# EAGLE schematic keyBoard_B (EAGLE 6.3)

## Sheet 1 of 2: all
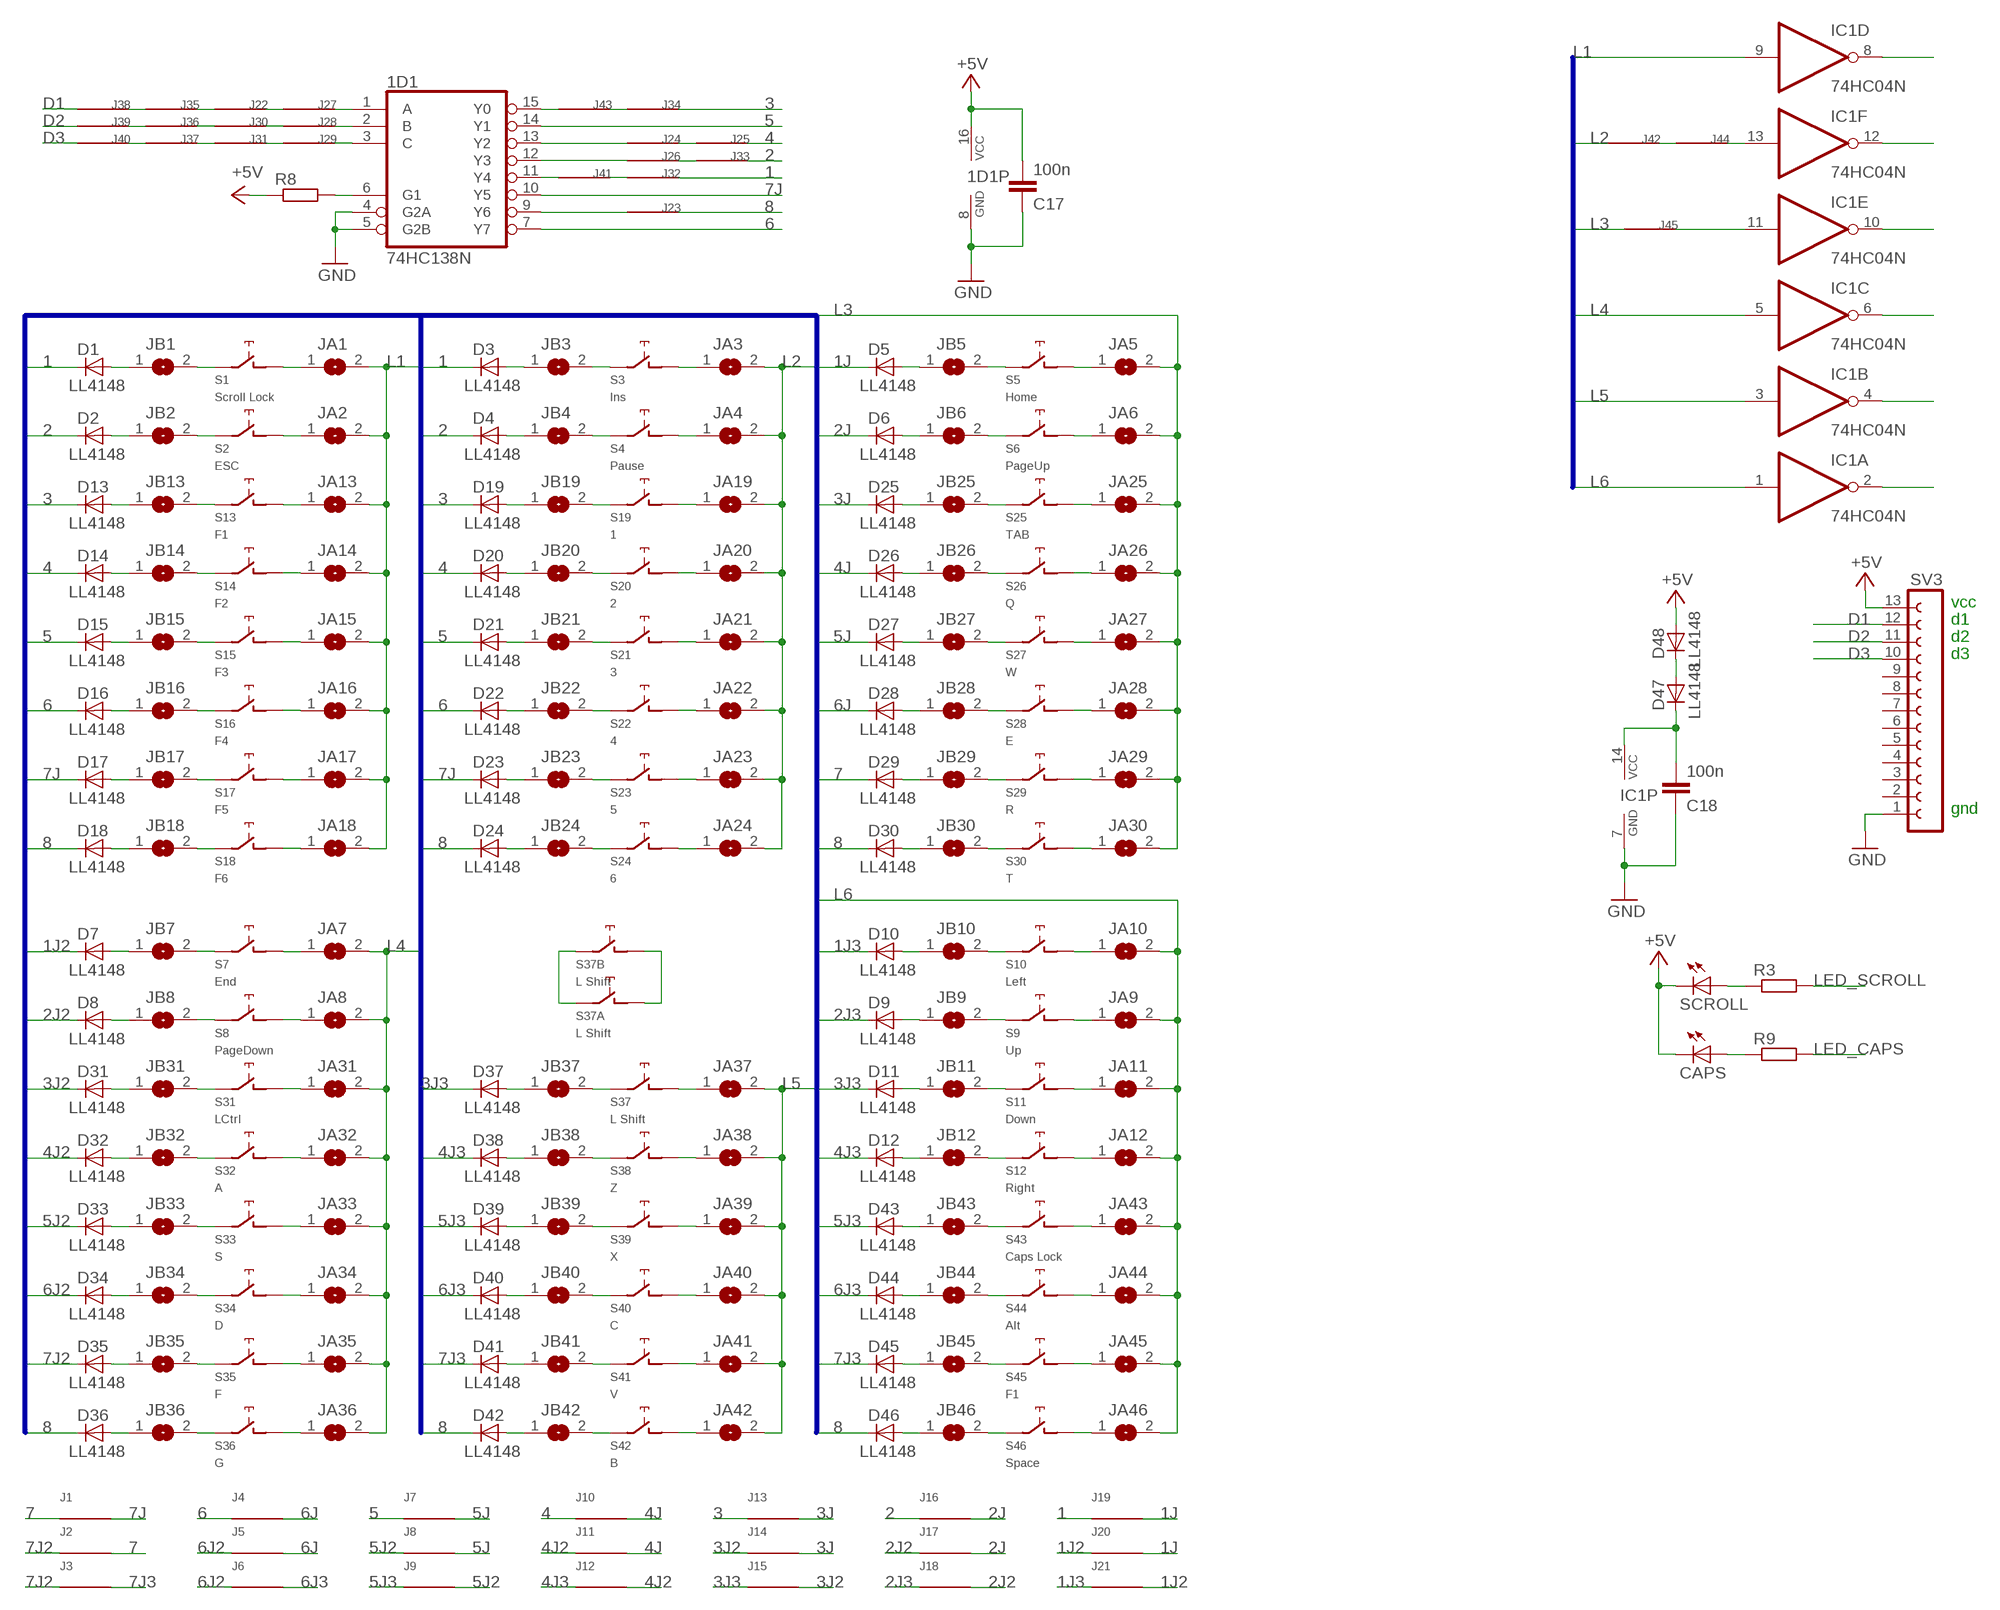
[diagram p0: schematic, sheet 1, part 1 of 2]
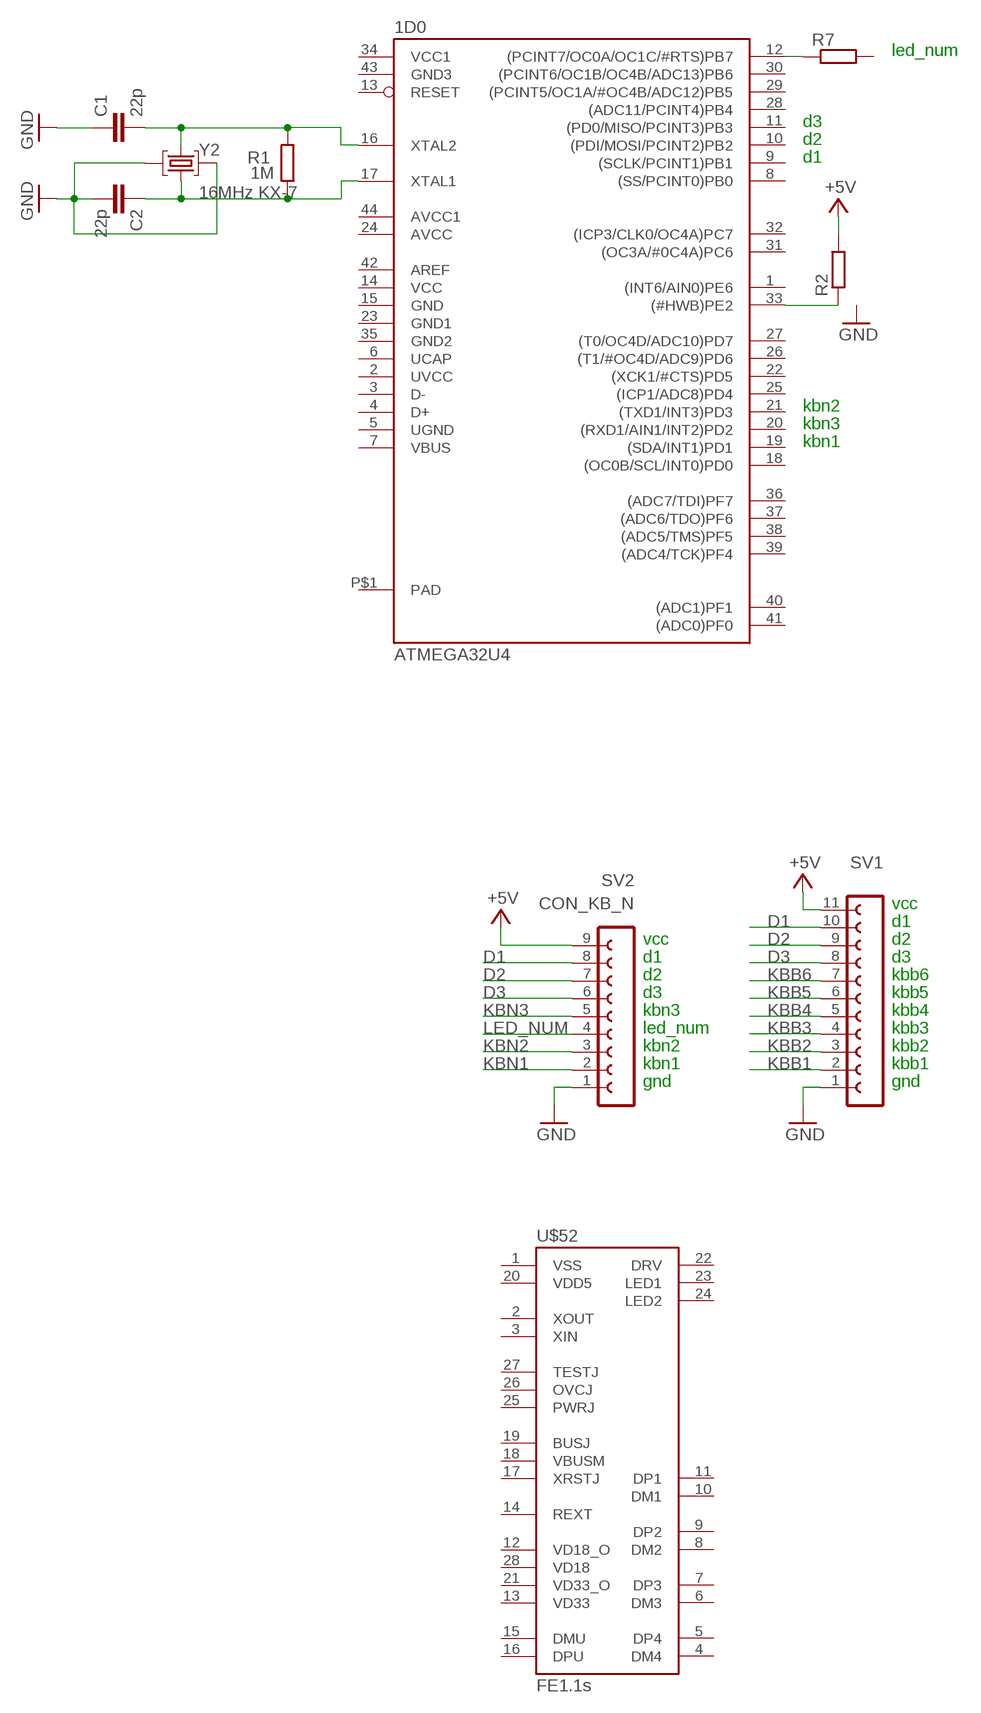
[diagram p1: schematic, sheet 1, part 2 of 2]

### Parts
1D0  ATMEGA32U4  SMARTPRJ_ATMEGA32U4-XUAU  [SMARTPRJ_TQFP44-PAD]
1D1  74HC138N  [DIL16]
C1  22p  C-EUC0603  [C0603-ROUND]
C2  22p  C-EUC0603  [C0603-ROUND]
C17  100n  C-EUC0805  [C0805]
C18  100n  C-EUC0805  [C0805]
CAPS  LED5MM  [LED5MM]
D1  LL4148  [SOD80C]
D2  LL4148  [SOD80C]
D3  LL4148  [SOD80C]
D4  LL4148  [SOD80C]
D5  LL4148  [SOD80C]
D6  LL4148  [SOD80C]
D7  LL4148  [SOD80C]
D8  LL4148  [SOD80C]
D9  LL4148  [SOD80C]
D10  LL4148  [SOD80C]
D11  LL4148  [SOD80C]
D12  LL4148  [SOD80C]
D13  LL4148  [SOD80C]
D14  LL4148  [SOD80C]
D15  LL4148  [SOD80C]
D16  LL4148  [SOD80C]
D17  LL4148  [SOD80C]
D18  LL4148  [SOD80C]
D19  LL4148  [SOD80C]
D20  LL4148  [SOD80C]
D21  LL4148  [SOD80C]
D22  LL4148  [SOD80C]
D23  LL4148  [SOD80C]
D24  LL4148  [SOD80C]
D25  LL4148  [SOD80C]
D26  LL4148  [SOD80C]
D27  LL4148  [SOD80C]
D28  LL4148  [SOD80C]
D29  LL4148  [SOD80C]
D30  LL4148  [SOD80C]
D31  LL4148  [SOD80C]
D32  LL4148  [SOD80C]
D33  LL4148  [SOD80C]
D34  LL4148  [SOD80C]
D35  LL4148  [SOD80C]
D36  LL4148  [SOD80C]
D37  LL4148  [SOD80C]
D38  LL4148  [SOD80C]
D39  LL4148  [SOD80C]
D40  LL4148  [SOD80C]
D41  LL4148  [SOD80C]
D42  LL4148  [SOD80C]
D43  LL4148  [SOD80C]
D44  LL4148  [SOD80C]
D45  LL4148  [SOD80C]
D46  LL4148  [SOD80C]
D47  LL4148  [SOD80C]
D48  LL4148  [SOD80C]
IC1  74HC04N  74ACT04N  [DIL14]
J1  J  [R1206W]
J2  J  [R1206W]
J3  J  [R1206W]
J4  J  [R1206W]
J5  J  [R1206W]
J6  J  [R1206W]
J7  J  [R1206W]
J8  J  [R1206W]
J9  J  [R1206W]
J10  J  [R1206W]
J11  J  [R1206W]
J12  J  [R1206W]
J13  J  [R1206W]
J14  J  [R1206W]
J15  J  [R1206W]
J16  J  [R1206W]
J17  J  [R1206W]
J18  J  [R1206W]
J19  J  [R1206W]
J20  J  [R1206W]
J21  J  [R1206W]
J22  J  [R1206W]
J23  J  [R1206W]
J24  J  [R1206W]
J25  J  [R1206W]
J26  J  [R1206W]
J27  J  [R1206W]
J28  J  [R1206W]
J29  J  [R1206W]
J30  J  [R1206W]
J31  J  [R1206W]
J32  J  [R1206W]
J33  J  [R1206W]
J34  J  [R1206W]
J35  J  [R1206W]
J36  J  [R1206W]
J37  J  [R1206W]
J38  J  [R1206W]
J39  J  [R1206W]
J40  J  [R1206W]
J41  J  [R1206W]
J42  J  [R1206W]
J43  J  [R1206W]
J44  J  [R1206W]
J45  J  [R1206W]
JA1  SJ  [SJ]
JA2  SJ  [SJ]
JA3  SJ  [SJ]
JA4  SJ  [SJ]
JA5  SJ  [SJ]
JA6  SJ  [SJ]
JA7  SJ  [SJ]
JA8  SJ  [SJ]
JA9  SJ  [SJ]
JA10  SJ  [SJ]
JA11  SJ  [SJ]
JA12  SJ  [SJ]
JA13  SJ  [SJ]
JA14  SJ  [SJ]
JA15  SJ  [SJ]
JA16  SJ  [SJ]
JA17  SJ  [SJ]
JA18  SJ  [SJ]
JA19  SJ  [SJ]
JA20  SJ  [SJ]
JA21  SJ  [SJ]
JA22  SJ  [SJ]
JA23  SJ  [SJ]
JA24  SJ  [SJ]
JA25  SJ  [SJ]
JA26  SJ  [SJ]
JA27  SJ  [SJ]
JA28  SJ  [SJ]
JA29  SJ  [SJ]
JA30  SJ  [SJ]
JA31  SJ  [SJ]
JA32  SJ  [SJ]
JA33  SJ  [SJ]
JA34  SJ  [SJ]
JA35  SJ  [SJ]
JA36  SJ  [SJ]
JA37  SJ  [SJ]
JA38  SJ  [SJ]
JA39  SJ  [SJ]
JA40  SJ  [SJ]
JA41  SJ  [SJ]
JA42  SJ  [SJ]
JA43  SJ  [SJ]
JA44  SJ  [SJ]
JA45  SJ  [SJ]
JA46  SJ  [SJ]
JB1  SJ  [SJ]
JB2  SJ  [SJ@1]
JB3  SJ  [SJ]
JB4  SJ  [SJ]
JB5  SJ  [SJ@1]
JB6  SJ  [SJ]
JB7  SJ  [SJ]
JB8  SJ  [SJ]
JB9  SJ  [SJ]
JB10  SJ  [SJ]
JB11  SJ  [SJ]
JB12  SJ  [SJ]
JB13  SJ  [SJ]
JB14  SJ  [SJ@1]
JB15  SJ  [SJ@1]
JB16  SJ  [SJ]
JB17  SJ  [SJ]
JB18  SJ  [SJ]
JB19  SJ  [SJ]
JB20  SJ  [SJ]
JB21  SJ  [SJ]
JB22  SJ  [SJ]
JB23  SJ  [SJ]
JB24  SJ  [SJ]
JB25  SJ  [SJ]
JB26  SJ  [SJ]
JB27  SJ  [SJ]
JB28  SJ  [SJ]
JB29  SJ  [SJ]
JB30  SJ  [SJ]
JB31  SJ  [SJ]
JB32  SJ  [SJ]
JB33  SJ  [SJ]
JB34  SJ  [SJ]
JB35  SJ  [SJ]
JB36  SJ  [SJ]
JB37  SJ  [SJ]
JB38  SJ  [SJ]
JB39  SJ  [SJ]
JB40  SJ  [SJ]
JB41  SJ  [SJ]
JB42  SJ  [SJ]
JB43  SJ  [SJ]
JB44  SJ  [SJ]
JB45  SJ  [SJ]
JB46  SJ  [SJ]
R1  1M  R-EU_R0603  [R0603-ROUND]
R2  R-EU_M0805  [M0805]
R3  R-EU_R1206W  [R1206W]
R7  R-EU_M0805  [M0805]
R8  R-EU_R1206W  [R1206W]
R9  R-EU_R1206W  [R1206W]
S1  Scroll Lock  CHERRY-MX-4P  [CHERRY-MX-4P]
S2  ESC  CHERRY-MX-4P  [CHERRY-MX-4P]
S3  Ins  CHERRY-MX-4P  [CHERRY-MX-4P]
S4  Pause  CHERRY-MX-4P  [CHERRY-MX-4P]
S5  Home  CHERRY-MX-4P  [CHERRY-MX-4P]
S6  PageUp  CHERRY-MX-4P  [CHERRY-MX-4P]
S7  End  CHERRY-MX-4P  [CHERRY-MX-4P]
S8  PageDown  CHERRY-MX-4P  [CHERRY-MX-4P]
S9  Up  CHERRY-MX-4P  [CHERRY-MX-4P]
S10  Left  CHERRY-MX-4P  [CHERRY-MX-4P]
S11  Down  CHERRY-MX-4P  [CHERRY-MX-4P]
S12  Right  CHERRY-MX-4P  [CHERRY-MX-4P]
S13  F1  CHERRY-MX-4P  [CHERRY-MX-4P]
S14  F2  CHERRY-MX-4P  [CHERRY-MX-4P]
S15  F3  CHERRY-MX-4P  [CHERRY-MX-4P]
S16  F4  CHERRY-MX-4P  [CHERRY-MX-4P]
S17  F5  CHERRY-MX-4P  [CHERRY-MX-4P]
S18  F6  CHERRY-MX-4P  [CHERRY-MX-4P]
S19  1  CHERRY-MX-4P  [CHERRY-MX-4P]
S20  2  CHERRY-MX-4P  [CHERRY-MX-4P]
S21  3  CHERRY-MX-4P  [CHERRY-MX-4P]
S22  4  CHERRY-MX-4P  [CHERRY-MX-4P]
S23  5  CHERRY-MX-4P  [CHERRY-MX-4P]
S24  6  CHERRY-MX-4P  [CHERRY-MX-4P]
S25  TAB  CHERRY-MX-4P  [CHERRY-MX-4P]
S26  Q  CHERRY-MX-4P  [CHERRY-MX-4P]
S27  W  CHERRY-MX-4P  [CHERRY-MX-4P]
S28  E  CHERRY-MX-4P  [CHERRY-MX-4P]
S29  R  CHERRY-MX-4P  [CHERRY-MX-4P]
S30  T  CHERRY-MX-4P  [CHERRY-MX-4P]
S31  LCtrl  CHERRY-MX-4P  [CHERRY-MX-4P]
S32  A  CHERRY-MX-4P  [CHERRY-MX-4P]
S33  S  CHERRY-MX-4P  [CHERRY-MX-4P]
S34  D  CHERRY-MX-4P  [CHERRY-MX-4P]
S35  F  CHERRY-MX-4P  [CHERRY-MX-4P]
S36  G  CHERRY-MX-4P  [CHERRY-MX-4P]
S37  L Shift  CHERRY-MX  [CHERRY-MX]
S37A  L Shift  CHERRY-MX  [CHERRY-MX]
S37B  L Shift  CHERRY-MX  [CHERRY-MX]
S38  Z  CHERRY-MX-4P  [CHERRY-MX-4P]
S39  X  CHERRY-MX-4P  [CHERRY-MX-4P]
S40  C  CHERRY-MX-4P  [CHERRY-MX-4P]
S41  V  CHERRY-MX-4P  [CHERRY-MX-4P]
S42  B  CHERRY-MX-4P  [CHERRY-MX-4P]
S43  Caps Lock  CHERRY-MX-4P  [CHERRY-MX-4P]
S44  Alt  CHERRY-MX-4P  [CHERRY-MX-4P]
S45  F1  CHERRY-MX-4P  [CHERRY-MX-4P]
S46  Space  CHERRY-MX-4P  [CHERRY-MX-4P]
SCROLL  LED5MM  [LED5MM]
SV1  FE12-1  [FE12]
SV2  CON_KB_N  FE09-1  [FE09]
SV3  FE13-1  [FE13]
U$52  FE1.1S  [FE1.1S_SSOP-28]
Y2  16MHz KX-7  CRYSTAL-3.2-2.5  [CRYSTAL-3.2-2.5]

### Nets
1: D1.C D3.C J19.2 J32.1
1J: D5.C J19.1 J20.1
1J2: D7.C J20.2 J21.1
1J3: D10.C J21.2
2: D2.C D4.C J16.2 J33.1
2J: D6.C J16.1 J17.1
2J2: D8.C J17.2 J18.1
2J3: D9.C J18.2
3: D13.C D19.C J13.2 J34.1
3J: D25.C J13.1 J14.1
3J2: D31.C J14.2 J15.1
3J3: D11.C D37.C J15.2
4: D14.C D20.C J10.2 J25.1
4J: D26.C J10.1 J11.1
4J2: D32.C J11.2 J12.1
4J3: D12.C D38.C J12.2
5: 1D1.14(Y1) D15.C D21.C J7.2
5J: D27.C J7.1 J8.1
5J2: D33.C J8.2 J9.1
5J3: D39.C D43.C J9.2
6: 1D1.7(Y7) D16.C D22.C J4.2
6J: D28.C J4.1 J5.1
6J2: D34.C J5.2 J6.2
6J3: D40.C D44.C J6.1
7: D29.C J1.2 J2.1
7J: 1D1.10(Y5) D17.C D23.C J1.1
7J2: D35.C J2.2 J3.2
7J3: D41.C D45.C J3.1
8: D18.C D24.C D30.C D36.C D42.C D46.C J23.1
+5V: 1D1.16(VCC) C17.2 CAPS.K(C) D48.A R2.2 R8.1 SCROLL.K(C) SV1.11 SV2.9 SV3.13 ; also sheet 2
D1: J38.2 SV1.10 SV2.8 SV3.12
D2: J39.2 SV1.9 SV2.7 SV3.11
D3: J40.2 SV1.8 SV2.6 SV3.10
GND: 1D1.4(G2A) 1D1.5(G2B) 1D1.8(GND) C1.1 C2.2 C17.1 C18.1 IC1.7(P:GND) SV1.1 SV2.1 SV3.1 Y2.2(GND) Y2.4(GND) ; also sheet 2
KBB1: SV1.2
KBB2: SV1.3
KBB3: SV1.4
KBB4: SV1.5
KBB5: SV1.6
KBB6: SV1.7
KBN1: SV2.2
KBN2: SV2.3
KBN3: SV2.5
L1: IC1.9(D:I) JA1.2 JA2.2 JA13.2 JA14.2 JA15.2 JA16.2 JA17.2 JA18.2
L2: J42.2 JA3.2 JA4.2 JA19.2 JA20.2 JA21.2 JA22.2 JA23.2 JA24.2
L3: J45.2 JA5.2 JA6.2 JA25.2 JA26.2 JA27.2 JA28.2 JA29.2 JA30.2
L4: IC1.5(C:I) JA7.2 JA8.2 JA31.2 JA32.2 JA33.2 JA34.2 JA35.2 JA36.2
L5: IC1.3(B:I) JA37.2 JA38.2 JA39.2 JA40.2 JA41.2 JA42.2
L6: IC1.1(A:I) JA9.2 JA10.2 JA11.2 JA12.2 JA43.2 JA44.2 JA45.2 JA46.2
LED_CAPS: R9.2
LED_NUM: SV2.4
LED_SCROLL: R3.2
N$1: D15.A JB15.1
N$2: JB4.2 S4.SW1(PIN-1)
N$3: D1.A JB1.1
N$4: JA4.1 S4.SW2(PIN-2)
N$5: JB14.2 S14.SW1(PIN-1)
N$6: JB20.2 S20.SW1(PIN-1)
N$7: JB32.2 S32.SW1(PIN-1)
N$8: JB38.2 S38.SW1(PIN-1)
N$9: JB6.2 S6.SW1(PIN-1)
N$10: JA6.1 S6.SW2(PIN-2)
N$11: JA8.1 S8.SW2(PIN-2)
N$12: JB8.2 S8.SW1(PIN-1)
N$13: JB10.2 S10.SW1(PIN-1)
N$14: JB1.2 S1.SW1(PIN-1)
N$15: D2.A JB2.1
N$16: JB2.2 S2.SW1(PIN-1)
N$17: JA2.1 S2.SW2(PIN-2)
N$18: D16.A JB16.1
N$19: JB3.2 S3.SW1(PIN-1)
N$20: JB5.2 S5.SW1(PIN-1)
N$21: JB7.2 S7.SW1(PIN-1)
N$22: JB9.2 S9.SW1(PIN-1)
N$23: JB11.2 S11.SW1(PIN-1)
N$24: D3.A JB3.1
N$25: JB12.2 S12.SW1(PIN-1)
N$26: D5.A JB5.1
N$27: D7.A JB7.1
N$28: JA10.1 S10.SW2(PIN-2)
N$29: JA1.1 S1.SW2(PIN-2)
N$30: D9.A JB9.1
N$31: D11.A JB11.1
N$32: JA3.1 S3.SW2(PIN-2)
N$33: JA5.1 S5.SW2(PIN-2)
N$34: JA7.1 S7.SW2(PIN-2)
N$35: JA9.1 S9.SW2(PIN-2)
N$36: JA11.1 S11.SW2(PIN-2)
N$37: JA12.1 S12.SW2(PIN-2)
N$38: JA14.1 S14.SW2(PIN-2)
N$39: JB13.2 S13.SW1(PIN-1)
N$40: JA13.1 S13.SW2(PIN-2)
N$41: D14.A JB14.1
N$42: JB42.2 S42.SW1(PIN-1)
N$43: JA42.1 S42.SW2(PIN-2)
N$44: JB27.2 S27.SW1(PIN-1)
N$45: JA27.1 S27.SW2(PIN-2)
N$46: JB17.2 S17.SW1(PIN-1)
N$47: JA17.1 S17.SW2(PIN-2)
N$48: D24.A JB24.1
N$49: JB24.2 S24.SW1(PIN-1)
N$50: JA24.1 S24.SW2(PIN-2)
N$51: J22.1 J27.2
N$52: D4.A JB4.1
N$53: D6.A JB6.1
N$54: D8.A JB8.1
N$55: D10.A JB10.1
N$56: D12.A JB12.1
N$57: D13.A JB13.1
N$58: JB19.2 S19.SW1(PIN-1)
N$59: JB25.2 S25.SW1(PIN-1)
N$60: 1D1.9(Y6) J23.2
N$61: JB31.2 S31.SW1(PIN-1)
N$62: JB37.2 S37.SW1(PIN-1)
N$63: JB43.2 S43.SW1(PIN-1)
N$64: JB26.2 S26.SW1(PIN-1)
N$65: JB44.2 S44.SW1(PIN-1)
N$66: JB18.2 S18.SW1(PIN-1)
N$67: 1D1.13(Y2) J24.2
N$68: JB30.2 S30.SW1(PIN-1)
N$69: JB36.2 S36.SW1(PIN-1)
N$70: J24.1 J25.2
N$72: JB23.2 S23.SW1(PIN-1)
N$73: JB29.2 S29.SW1(PIN-1)
N$74: JB35.2 S35.SW1(PIN-1)
N$75: JB41.2 S41.SW1(PIN-1)
N$76: JB16.2 S16.SW1(PIN-1)
N$77: JB22.2 S22.SW1(PIN-1)
N$78: JB28.2 S28.SW1(PIN-1)
N$79: JB34.2 S34.SW1(PIN-1)
N$80: JB40.2 S40.SW1(PIN-1)
N$81: JB46.2 S46.SW1(PIN-1)
N$82: JB15.2 S15.SW1(PIN-1)
N$83: JB21.2 S21.SW1(PIN-1)
N$85: JB33.2 S33.SW1(PIN-1)
N$86: JB39.2 S39.SW1(PIN-1)
N$87: JB45.2 S45.SW1(PIN-1)
N$88: JA15.1 S15.SW2(PIN-2)
N$90: JA18.1 S18.SW2(PIN-2)
N$91: JA20.1 S20.SW2(PIN-2)
N$92: JA22.1 S22.SW2(PIN-2)
N$93: JA23.1 S23.SW2(PIN-2)
N$95: JA25.1 S25.SW2(PIN-2)
N$96: JA26.1 S26.SW2(PIN-2)
N$98: JA28.1 S28.SW2(PIN-2)
N$99: JA29.1 S29.SW2(PIN-2)
N$100: JA30.1 S30.SW2(PIN-2)
N$101: JA31.1 S31.SW2(PIN-2)
N$102: JA32.1 S32.SW2(PIN-2)
N$103: JA33.1 S33.SW2(PIN-2)
N$104: JA34.1 S34.SW2(PIN-2)
N$105: JA35.1 S35.SW2(PIN-2)
N$106: JA36.1 S36.SW2(PIN-2)
N$107: S37A.SW1(PIN-1) S37B.SW1(PIN-1)
N$108: JA38.1 S38.SW2(PIN-2)
N$109: JA39.1 S39.SW2(PIN-2)
N$110: JA40.1 S40.SW2(PIN-2)
N$111: JA41.1 S41.SW2(PIN-2)
N$113: JA43.1 S43.SW2(PIN-2)
N$114: JA45.1 S45.SW2(PIN-2)
N$115: JA46.1 S46.SW2(PIN-2)
N$116: JA19.1 S19.SW2(PIN-2)
N$117: JA44.1 S44.SW2(PIN-2)
N$118: JA21.1 S21.SW2(PIN-2)
N$119: JA16.1 S16.SW2(PIN-2)
N$120: D17.A JB17.1
N$121: D18.A JB18.1
N$122: D19.A JB19.1
N$123: D20.A JB20.1
N$124: D21.A JB21.1
N$125: D22.A JB22.1
N$126: D23.A JB23.1
N$128: D25.A JB25.1
N$129: D26.A JB26.1
N$130: D27.A JB27.1
N$131: D28.A JB28.1
N$132: D29.A JB29.1
N$133: D30.A JB30.1
N$134: D31.A JB31.1
N$135: D32.A JB32.1
N$136: D33.A JB33.1
N$137: D34.A JB34.1
N$138: D35.A JB35.1
N$139: D36.A JB36.1
N$140: D37.A JB37.1
N$141: D38.A JB38.1
N$142: D39.A JB39.1
N$143: D40.A JB40.1
N$144: D41.A JB41.1
N$145: D42.A JB42.1
N$146: D43.A JB43.1
N$147: D44.A JB44.1
N$148: D45.A JB45.1
N$149: D46.A JB46.1
N$150: J42.1 J44.2
N$158: 1D1.15(Y0) J43.2
N$163: 1D1.1(A) J27.1
N$165: 1D1.2(B) J28.1
N$172: 1D1.3(C) J29.1
N$175: J28.2 J30.1
N$176: J29.2 J31.1
N$178: J26.1 J33.2
N$181: C18.2 D47.C IC1.14(P:VCC)
N$182: J35.2 J38.1
N$183: J36.2 J39.1
N$184: J37.2 J40.1
N$185: J31.2 J37.1
N$186: J30.2 J36.1
N$187: J22.2 J35.1
N$188: J32.2 J41.1
N$189: 1D1.11(Y4) J41.2
N$190: 1D1.12(Y3) J26.2
N$191: J34.2 J43.1
N$192: D47.A D48.C
N$193: IC1.11(E:I) J45.1
N$194: IC1.13(F:I) J44.1
N$195: IC1.12(F:O)
N$196: IC1.10(E:O)
N$197: 1D0.33((#HWB)PE2) R2.1
N$198: IC1.2(A:O)
N$199: IC1.4(B:O)
N$200: IC1.6(C:O)
N$203: IC1.8(D:O)
N$231: R3.1 SCROLL.A
N$232: CAPS.A R9.1
N$273: JA37.1 S37.SW2(PIN-2)
N$274: S37A.SW2(PIN-2) S37B.SW2(PIN-2)
N$284: 1D0.12((PCINT7/OC0A/OC1C/#RTS)PB7) R7.1
N$390: 1D1.6(G1) R8.2
XTAL3: 1D0.16(XTAL2) C1.2 R1.2 Y2.3(C2)
XTAL4: 1D0.17(XTAL1) C2.1 R1.1 Y2.1(C1)
Unconnected: 1D0.1((INT6/AIN0)PE6) 1D0.3(D-) 1D0.4(D+) 1D0.6(UCAP) 1D0.7(VBUS) 1D0.8((SS/PCINT0)PB0) 1D0.9((SCLK/PCINT1)PB1) 1D0.10((PDI/MOSI/PCINT2)PB2) 1D0.11((PD0/MISO/PCINT3)PB3) 1D0.13(RESET) 1D0.18((OC0B/SCL/INT0)PD0) 1D0.19((SDA/INT1)PD1) 1D0.20((RXD1/AIN1/INT2)PD2) 1D0.21((TXD1/INT3)PD3) 1D0.22((XCK1/#CTS)PD5) 1D0.25((ICP1/ADC8)PD4) 1D0.26((T1/#OC4D/ADC9)PD6) 1D0.27((T0/OC4D/ADC10)PD7) 1D0.28((ADC11/PCINT4)PB4) 1D0.29((PCINT5/OC1A/#OC4B/ADC12)PB5) 1D0.30((PCINT6/OC1B/OC4B/ADC13)PB6) 1D0.31((OC3A/#0C4A)PC6) 1D0.32((ICP3/CLK0/OC4A)PC7) 1D0.36((ADC7/TDI)PF7) 1D0.37((ADC6/TDO)PF6) 1D0.38((ADC5/TMS)PF5) 1D0.39((ADC4/TCK)PF4) 1D0.40((ADC1)PF1) 1D0.41((ADC0)PF0) R7.2 S1.D1(_D:D1) S1.D2(_D:D2) S1.LED1(_L:LED1) S1.LED2(_L:LED2) S2.D1(_D:D1) S2.D2(_D:D2) S2.LED1(_L:LED1) S2.LED2(_L:LED2) S3.D1(_D:D1) S3.D2(_D:D2) S3.LED1(_L:LED1) S3.LED2(_L:LED2) S4.D1(_D:D1) S4.D2(_D:D2) S4.LED1(_L:LED1) S4.LED2(_L:LED2) S5.D1(_D:D1) S5.D2(_D:D2) S5.LED1(_L:LED1) S5.LED2(_L:LED2) S6.D1(_D:D1) S6.D2(_D:D2) S6.LED1(_L:LED1) S6.LED2(_L:LED2) S7.D1(_D:D1) S7.D2(_D:D2) S7.LED1(_L:LED1) S7.LED2(_L:LED2) S8.D1(_D:D1) S8.D2(_D:D2) S8.LED1(_L:LED1) S8.LED2(_L:LED2) S9.D1(_D:D1) S9.D2(_D:D2) S9.LED1(_L:LED1) S9.LED2(_L:LED2) S10.D1(_D:D1) S10.D2(_D:D2) S10.LED1(_L:LED1) S10.LED2(_L:LED2) S11.D1(_D:D1) S11.D2(_D:D2) S11.LED1(_L:LED1) S11.LED2(_L:LED2) S12.D1(_D:D1) S12.D2(_D:D2) S12.LED1(_L:LED1) S12.LED2(_L:LED2) S13.D1(_D:D1) S13.D2(_D:D2) S13.LED1(_L:LED1) S13.LED2(_L:LED2) S14.D1(_D:D1) S14.D2(_D:D2) S14.LED1(_L:LED1) S14.LED2(_L:LED2) S15.D1(_D:D1) S15.D2(_D:D2) S15.LED1(_L:LED1) S15.LED2(_L:LED2) S16.D1(_D:D1) S16.D2(_D:D2) S16.LED1(_L:LED1) S16.LED2(_L:LED2) S17.D1(_D:D1) S17.D2(_D:D2) S17.LED1(_L:LED1) S17.LED2(_L:LED2) S18.D1(_D:D1) S18.D2(_D:D2) S18.LED1(_L:LED1) S18.LED2(_L:LED2) S19.D1(_D:D1) S19.D2(_D:D2) S19.LED1(_L:LED1) S19.LED2(_L:LED2) S20.D1(_D:D1) S20.D2(_D:D2) S20.LED1(_L:LED1) S20.LED2(_L:LED2) S21.D1(_D:D1) S21.D2(_D:D2) S21.LED1(_L:LED1) S21.LED2(_L:LED2) S22.D1(_D:D1) S22.D2(_D:D2) S22.LED1(_L:LED1) S22.LED2(_L:LED2) S23.D1(_D:D1) S23.D2(_D:D2) S23.LED1(_L:LED1) S23.LED2(_L:LED2) S24.D1(_D:D1) S24.D2(_D:D2) S24.LED1(_L:LED1) S24.LED2(_L:LED2) S25.D1(_D:D1) S25.D2(_D:D2) S25.LED1(_L:LED1) S25.LED2(_L:LED2) S26.D1(_D:D1) S26.D2(_D:D2) S26.LED1(_L:LED1) S26.LED2(_L:LED2) S27.D1(_D:D1) S27.D2(_D:D2) S27.LED1(_L:LED1) S27.LED2(_L:LED2) S28.D1(_D:D1) S28.D2(_D:D2) S28.LED1(_L:LED1) S28.LED2(_L:LED2) S29.D1(_D:D1) S29.D2(_D:D2) S29.LED1(_L:LED1) S29.LED2(_L:LED2) S30.D1(_D:D1) S30.D2(_D:D2) S30.LED1(_L:LED1) S30.LED2(_L:LED2) S31.D1(_D:D1) S31.D2(_D:D2) S31.LED1(_L:LED1) S31.LED2(_L:LED2) S32.D1(_D:D1) S32.D2(_D:D2) S32.LED1(_L:LED1) S32.LED2(_L:LED2) S33.D1(_D:D1) S33.D2(_D:D2) S33.LED1(_L:LED1) S33.LED2(_L:LED2) S34.D1(_D:D1) S34.D2(_D:D2) S34.LED1(_L:LED1) S34.LED2(_L:LED2) S35.D1(_D:D1) S35.D2(_D:D2) S35.LED1(_L:LED1) S35.LED2(_L:LED2) S36.D1(_D:D1) S36.D2(_D:D2) S36.LED1(_L:LED1) S36.LED2(_L:LED2) S38.D1(_D:D1) S38.D2(_D:D2) S38.LED1(_L:LED1) S38.LED2(_L:LED2) S39.D1(_D:D1) S39.D2(_D:D2) S39.LED1(_L:LED1) S39.LED2(_L:LED2) S40.D1(_D:D1) S40.D2(_D:D2) S40.LED1(_L:LED1) S40.LED2(_L:LED2) S41.D1(_D:D1) S41.D2(_D:D2) S41.LED1(_L:LED1) S41.LED2(_L:LED2) S42.D1(_D:D1) S42.D2(_D:D2) S42.LED1(_L:LED1) S42.LED2(_L:LED2) S43.D1(_D:D1) S43.D2(_D:D2) S43.LED1(_L:LED1) S43.LED2(_L:LED2) S44.D1(_D:D1) S44.D2(_D:D2) S44.LED1(_L:LED1) S44.LED2(_L:LED2) S45.D1(_D:D1) S45.D2(_D:D2) S45.LED1(_L:LED1) S45.LED2(_L:LED2) S46.D1(_D:D1) S46.D2(_D:D2) S46.LED1(_L:LED1) S46.LED2(_L:LED2) SV3.2 SV3.3 SV3.4 SV3.5 SV3.6 SV3.7 SV3.8 SV3.9 U$52.1(VSS) U$52.2(XOUT) U$52.3(XIN) U$52.4(DM4) U$52.5(DP4) U$52.6(DM3) U$52.7(DP3) U$52.8(DM2) U$52.9(DP2) U$52.10(DM1) U$52.11(DP1) U$52.12(VD18_O) U$52.13(VD33) U$52.14(REXT) U$52.15(DMU) U$52.16(DPU) U$52.17(XRSTJ) U$52.18(VBUSM) U$52.19(BUSJ) U$52.20(VDD5) U$52.21(VD33_O) U$52.22(DRV) U$52.23(LED1) U$52.24(LED2) U$52.25(PWRJ) U$52.26(OVCJ) U$52.27(TESTJ) U$52.28(VD18)

### Buses
L[1..6],1,2,3,4,5,6,7,8,1J,2J,3J,4J,5J,6J,7J,1J2,1J3,2J2,2J3,3J2,3J3,4J2,4J3,5J2,5J3,6J2,6J3,7J2,7J3,7J4

### Notes on the sheet
- led_num
- d3
- d2
- d1
- kbn2
- kbn3
- kbn1
- vcc
- d1
- d2
- d3
- gnd
- vcc
- d1
- vcc | d2
- d1 | d3
- d2 | kbb6
- d3 | kbb5
- kbn3 | kbb4
- led_num | kbb3
- kbn2 | kbb2
- kbn1 | kbb1
- gnd | gnd

## Sheet 2 of 2
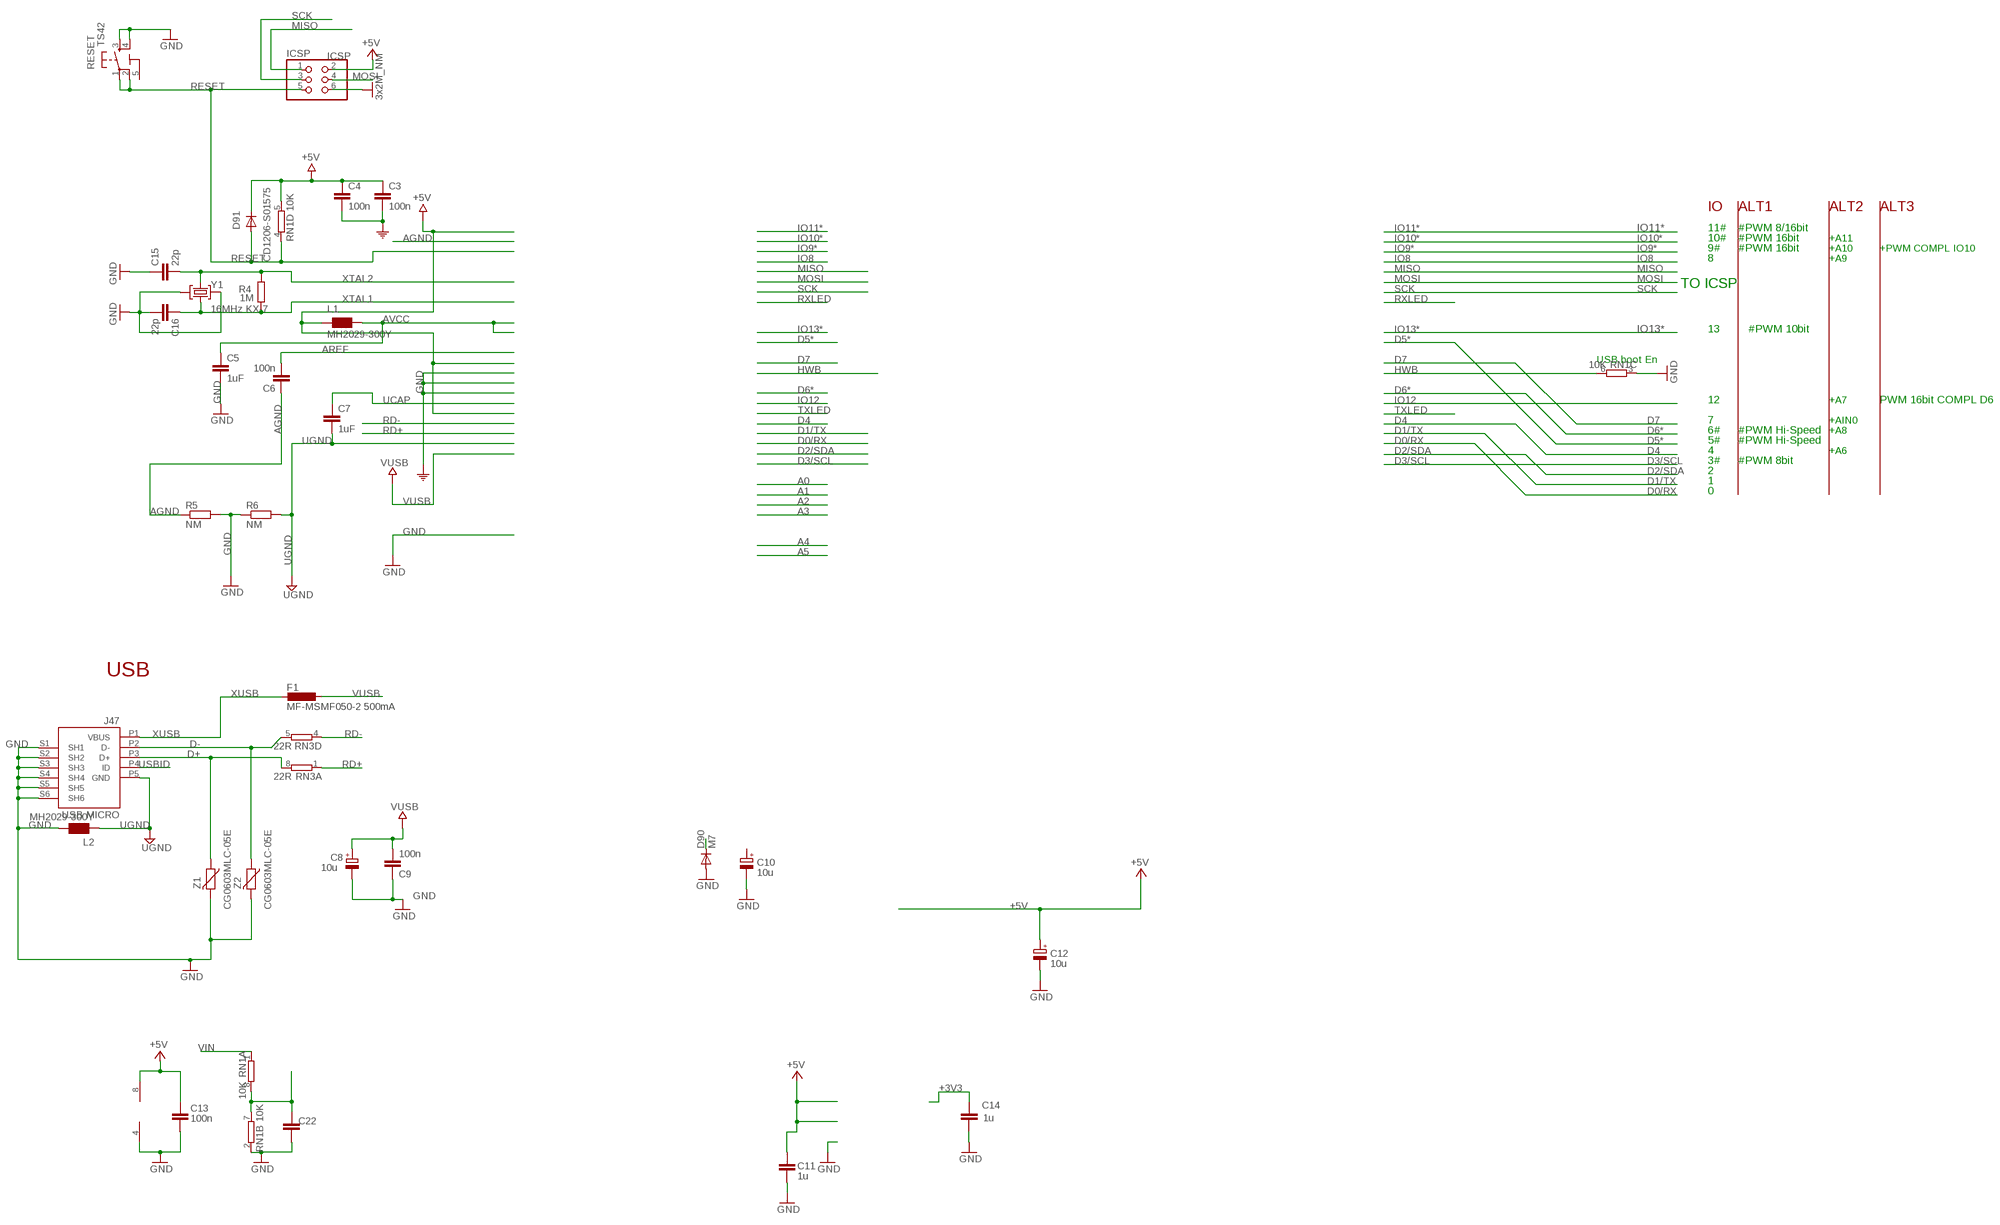
[diagram p2: schematic, sheet 2]

### Parts
C3  100n  C-EUC0603  [C0603-ROUND]
C4  100n  C-EUC0603  [C0603-ROUND]
C5  1uF  C-EUC0603  [C0603-ROUND]
C6  100n  C-EUC0603  [C0603-ROUND]
C7  1uF  C-EUC0603  [C0603-ROUND]
C8  10u  CPOL-EUSMCB  [SMC_B]
C9  100n  C-EUC0603  [C0603-ROUND]
C10  10u  CPOL-EUSMCB  [SMC_B]
C11  1u  C-EUC0603  [C0603-ROUND]
C12  10u  CPOL-EUSMCB  [SMC_B]
C13  100n  C-EUC0603  [C0603-ROUND]
C14  1u  C-EUC0603  [C0603-ROUND]
C15  22p  C-EUC0603  [C0603-ROUND]
C16  22p  C-EUC0603  [C0603-ROUND]
C22  100n  C-EUC0603  [C0603-ROUND]
D90  M7  DIODE-SMB  [SMB]
D91  CD1206-S01575  DIODE-MINIMELF  [MINIMELF]
F1  MF-MSMF050-2 500mA  L-EUL1812  [L1812]
IC2  LMV358IDGKR  LMV358MMX  [MSOP08]
ICSP  ICSP  PINHD-2X3  [2X03]
J47  USB MICRO  MYCON2_USB-MINI-B  [CON2_USB_MICRO_B_AT]
L1  MH2029-300Y  WE-CBF_0805  [0805]
L2  MH2029-300Y  WE-CBF_0805  [0805]
R4  1M  R-EU_R0603  [R0603-ROUND]
R5  NM  R-EU_R0402  [R0402]
R6  NM  R-EU_R0402  [R0402]
RESET  TS42  [TS42]
RN1  10K  4R-NCAY16  [CAY16]
RN3  22R  4R-NCAY16  [CAY16]
Y1  16MHz KX-7  CRYSTAL-3.2-2.5  [CRYSTAL-3.2-2.5]
Z1  CG0603MLC-05E  VARISTORCN0603  [CT/CN0603]
Z2  CG0603MLC-05E  VARISTORCN0603  [CT/CN0603]

### Nets
+3V3: C14.2
+5V: C3.1 C4.1 C11.2 C12.+ C13.1 D91.C IC2.8(P:V+) ICSP.2 L1.1 RN1.5 ; also sheet 1
AGND: C6.1 R5.1
AREF [aref]: C6.2
AVCC: C5.1 L1.2
CMP: C22.2 RN1.7 RN1.8
D+: J47.P3(D+) RN3.8 Z1.1
D-: J47.P2(D-) RN3.5 Z2.1
GND: C3.2 C4.2 C5.2 C8.- C9.1 C10.- C11.1 C12.- C13.2 C14.1 C15.1 C16.2 C22.1 D90.A IC2.4(P:V-) ICSP.6 J47.S1(SH1) J47.S2(SH2) J47.S3(SH3) J47.S4(SH4) J47.S5(SH5) J47.S6(SH6) L2.2 R5.2 R6.1 RESET.3 RESET.4 RN1.2 RN1.3 Y1.2(GND) Y1.4(GND) Z1.2 Z2.2 ; supply symbol labelled 3x2M_NM, COM ; also sheet 1
HWB: RN1.6
MISO: ICSP.1
MOSI: ICSP.4
RD+: RN3.1
RD-: RN3.4
RESET: D91.A ICSP.5 RESET.1 RESET.2 RN1.4
SCK: ICSP.3
UCAP: C7.1
UGND [gnd]: C7.2 J47.P5(GND) L2.1 R6.2
USBID: J47.P4(ID)
VIN [power]: D90.C RN1.1
VUSB: C8.+ C9.2 F1.1
XTAL1: C16.1 R4.1 Y1.1(C1)
XTAL2: C15.2 R4.2 Y1.3(C2)
XUSB [usbvcc]: F1.2 J47.P1(VBUS)
Unconnected: C10.+ IC2.1(A:OUT) IC2.2(A:-IN) IC2.3(A:+IN) IC2.5(B:+IN) IC2.6(B:-IN) IC2.7(B:OUT) RN3.2 RN3.3 RN3.6 RN3.7

### Notes on the sheet
- IO | ALT1 | ALT2 | ALT3
- 11# | #PWM 8/16bit
- 10# | #PWM 16bit | +A11
- 9# | #PWM 16bit | +A10 | +PWM COMPL IO10
- 8 | +A9
- TO ICSP
- 13 | #PWM 10bit
- USB boot En
- 12 | +A7 | PWM 16bit COMPL D6
- 7 | +AIN0
- 6# | #PWM Hi-Speed | +A8
- 5# | #PWM Hi-Speed
- 4 | +A6
- 3# | #PWM 8bit
- 2
- 1
- 0
- USB

## Power pins joined to a net without a drawn wire
5-GND: RESET.5(5-GND)
AREF: 1D0.42(AREF)
AVCC: 1D0.24(AVCC)
AVCC1: 1D0.44(AVCC1)
GND: 1D0.15(GND)
GND1: 1D0.23(GND1)
GND2: 1D0.35(GND2)
GND3: 1D0.43(GND3)
PAD: 1D0.P$1(PAD)
UGND: 1D0.5(UGND)
UVCC: 1D0.2(UVCC)
VCC: 1D0.14(VCC)
VCC1: 1D0.34(VCC1)

## Library data of the parts
1D0 = detali_main:SMARTPRJ_ATMEGA32U4-XU
1D1 = detali_main:74*138: 3-line to 8-line DECODER/DEMULTIPLEXER
C1-C7 C9 C11 C13-C16 C22 = SmartPrj:C-EU: CAPACITOR, European symbol
C8 C10 C12 = rcl:CPOL-EU: POLARIZED CAPACITOR, European symbol
C17 C18 = rcl:C-EU: CAPACITOR, European symbol
CAPS SCROLL = detali_main:LED: LED OSRAM: - CHIPLED LG R971, LG N971, LY N971, LG Q971, LY Q971, LO R971, LY R971 LH N974, LH R974 LS Q976, LO Q976, LY Q976 LO Q996 - Hyper CHIPLED LW Q18S LB Q993, LB Q99A, LB R99A - SideLED LS A670, LO A670, LY A670, LG A670, LP A670 LB A673, LV A673, LT A673, LW A673 LH A674 LY A675 LS A676, LA A676, LO A676, LY A676, LW A676 LS A679, LY A679, LG A679 - Hyper Micro SIDELED® LS Y876, LA Y876, LO Y876, LY Y876 LT Y87S - SmartLED LW L88C, LW L88S LB L89C, LB L89S, LG L890 LS L89K, LO L89K, LY L89K LS L896, LA L896, LO L896, LY L896 - TOPLED LS T670, LO T670, LY T670, LG T670, LP T670 LSG T670, LSP T670, LSY T670, LOP T670, LYG T670 LG T671, LOG T671, LSG T671 LB T673, LV T673, LT T673, LW T673 LH T674 LS T676, LA T676, LO T676, LY T676, LB T676, LH T676, LSB T676, LW T676 LB T67C, LV T67C, LT T67C, LS T67K, LO T67K, LY T67K, LW E67C LS E67B, LA E67B, LO E67B, LY E67B, LB E67C, LV E67C, LT E67C LW T67C LS T679, LY T679, LG T679 LS T770, LO T770, LY T770, LG T770, LP T770 LB T773, LV T773, LT T773, LW T773 LH T774 LS E675, LA E675, LY E675, LS T675 LS T776, LA T776, LO T776, LY T776, LB T776 LHGB T686 LT T68C, LB T68C - Hyper Mini TOPLED® LB M676 - Mini TOPLED Santana® LG M470 LS M47K, LO M47K, LY M47K Source: http://www.osram.convergy.de LUXEON: - LUMILED® LXK2-PW12-R00, LXK2-PW12-S00, LXK2-PW14-U00, LXK2-PW14-V00 LXK2-PM12-R00, LXK2-PM12-S00, LXK2-PM14-U00 LXK2-PE12-Q00, LXK2-PE12-R00, LXK2-PE12-S00, LXK2-PE14-T00, LXK2-PE14-U00 LXK2-PB12-K00, LXK2-PB12-L00, LXK2-PB12-M00, LXK2-PB14-N00, LXK2-PB14-P00, LXK2-PB14-Q00 LXK2-PR12-L00, LXK2-PR12-M00, LXK2-PR14-Q00, LXK2-PR14-R00 LXK2-PD12-Q00, LXK2-PD12-R00, LXK2-PD12-S00 LXK2-PH12-R00, LXK2-PH12-S00 LXK2-PL12-P00, LXK2-PL12-Q00, LXK2-PL12-R00 Source: www.luxeon.com KINGBRIGHT: KA-3528ASYC Source: www.kingbright.com
D1-D48 = detali:LL4148: DIODE high speed
D90 D91 = diode:DIODE-: DIODE
F1 = rcl:L-EU: INDUCTOR, European symbol
IC1 = detali_main:74*04: Hex INVERTER
IC2 = linear:LMV358?*: Dual General Purpose, Low Voltage, Rail-to-Rail Output Operational Amplifiers Source: http://www.national.com/mpf/LM/LMV321.html http://www.national.com/dt/lmv_qual.pdf
ICSP = SmartPrj:PINHD-2X3: PIN HEADER
J1-J45 = detali_main:J
J47 = SmartPrj:MYCON2_USB-MINI-B
JA1-JA12 JA43 JB4 JB6-JB13 JB16 JB17 = detali_main:SJ: SMD solder JUMPER
JA13-JA42 JA44-JA46 JB1 JB3 JB18-JB46 = detali:SJ: SMD solder JUMPER
JB2 JB5 JB14 JB15 = jumper:SJ: SMD solder JUMPER
L1 L2 = wuerth-elektronik:WE-CBF: SMD EMI Suppression Ferrite Beads - excellent anti-EMI properties - low DCR - impedances till 3000 ohms - rated current up to 6 A
R1 R4-R6 = SmartPrj:R-EU_: RESISTOR, European symbol
R2 R3 R7-R9 = rcl:R-EU_: RESISTOR, European symbol
RESET = SmartPrj:TS42: TS42 Dongnan Electronics Tact switch VDC 12V - 50mA
RN1 RN3 = resistor-dil:4R-N: Array Chip Resistor Source: RS Component / Phycomp
S1-S36 S38-S46 = cherrymx:CHERRY-MX-4P
S37 S37A S37B = cherrymx:CHERRY-MX: Cherry MX series keyswitch
SV1 = detali_main:FE12-1: FEMALE HEADER; OC_FARNELL: unknown; OC_NEWARK: unknown
SV2 = detali_main:FE09-1: FEMALE HEADER; OC_FARNELL: unknown; OC_NEWARK: unknown
SV3 = detali_main:FE13-1: FEMALE HEADER; OC_FARNELL: unknown; OC_NEWARK: unknown
U$52 = imcom:FE1.1S: A USB 2.0 hub IC. http://www.jfd-ic.com/Documents/FE1.1s%20Data%20Sheet%20%28Rev.%201.0%29.pdf
Y1 Y2 = SmartPrj:CRYSTAL-3.2-2.5
Z1 Z2 = varistor:VARISTOR: VARISTOR

## Net classes
0 default: width 0.254 mm, drill 0.61 mm, clearance 0.254 mm
1 power: width 0.254 mm, drill 0.61 mm, clearance 0.254 mm
2 gnd: width 0.254 mm, drill 0.61 mm, clearance 0.254 mm
3 usbvcc: width 0.254 mm, drill 0.61 mm, clearance 0.254 mm
4 aref: width 0.254 mm, drill 0.61 mm, clearance 0.254 mm